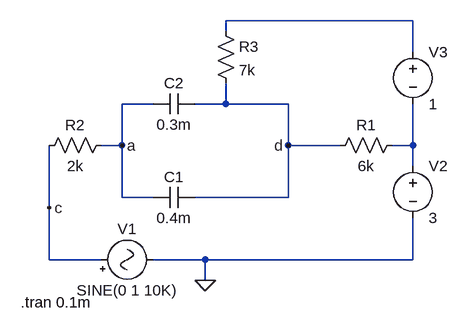
[diagram p0: schematic ooftest5.asc]
ooftest5.asc, the LTspice schematic file:
Version 4
SHEET 1 880 680
WIRE 464 -224 176 -224
WIRE 176 -208 176 -224
WIRE 464 -176 464 -224
WIRE 64 -96 16 -96
WIRE 176 -96 176 -128
WIRE 176 -96 128 -96
WIRE 272 -96 176 -96
WIRE 16 -32 16 -96
WIRE 16 -32 -16 -32
WIRE 272 -32 272 -96
WIRE 352 -32 272 -32
WIRE 464 -32 464 -96
WIRE 464 -32 432 -32
WIRE 464 0 464 -32
WIRE 16 48 16 -32
WIRE 64 48 16 48
WIRE 272 48 272 -32
WIRE 272 48 128 48
WIRE -96 64 -96 -32
WIRE -96 144 -96 64
WIRE -16 144 -96 144
WIRE 144 144 64 144
WIRE 464 144 464 80
WIRE 464 144 144 144
WIRE 144 176 144 144
FLAG 144 176 0
FLAG 16 -32 a
FLAG -96 64 c
FLAG 272 -32 d
SYMBOL res 336 -16 R270
WINDOW 0 32 56 VTop 2
WINDOW 3 0 56 VBottom 2
SYMATTR InstName R1
SYMATTR Value 6k
SYMBOL res 0 -48 R90
WINDOW 0 0 56 VBottom 2
WINDOW 3 32 56 VTop 2
SYMATTR InstName R2
SYMATTR Value 2k
SYMBOL res 160 -224 R0
SYMATTR InstName R3
SYMATTR Value 7k
SYMBOL Misc\\signal -32 144 R270
WINDOW 0 32 56 VTop 2
WINDOW 3 -32 56 VBottom 2
SYMATTR InstName V1
SYMATTR Value SINE(0 1 10K)
SYMBOL cap 128 -112 R90
WINDOW 0 0 32 VBottom 2
WINDOW 3 32 32 VTop 2
SYMATTR InstName C2
SYMATTR Value 0.3m
SYMBOL cap 128 32 R90
WINDOW 0 0 32 VBottom 2
WINDOW 3 32 32 VTop 2
SYMATTR InstName C1
SYMATTR Value 0.4m
SYMBOL voltage 464 -16 R0
SYMATTR InstName V2
SYMATTR Value 3
SYMBOL voltage 464 -192 R0
SYMATTR InstName V3
SYMATTR Value 1
TEXT -140 210 Left 2 !.tran 0.1m

The netlist it stands for:
* ooftest5.asc
R1 d N002 6k
R2 a c 2k
R3 N001 d 7k
V1 c 0 SINE(0 1 10K)
C2 d a 0.3m
C1 d a 0.4m
V2 N002 0 3
V3 N001 N002 1
.tran 0.1m
.backanno
.end